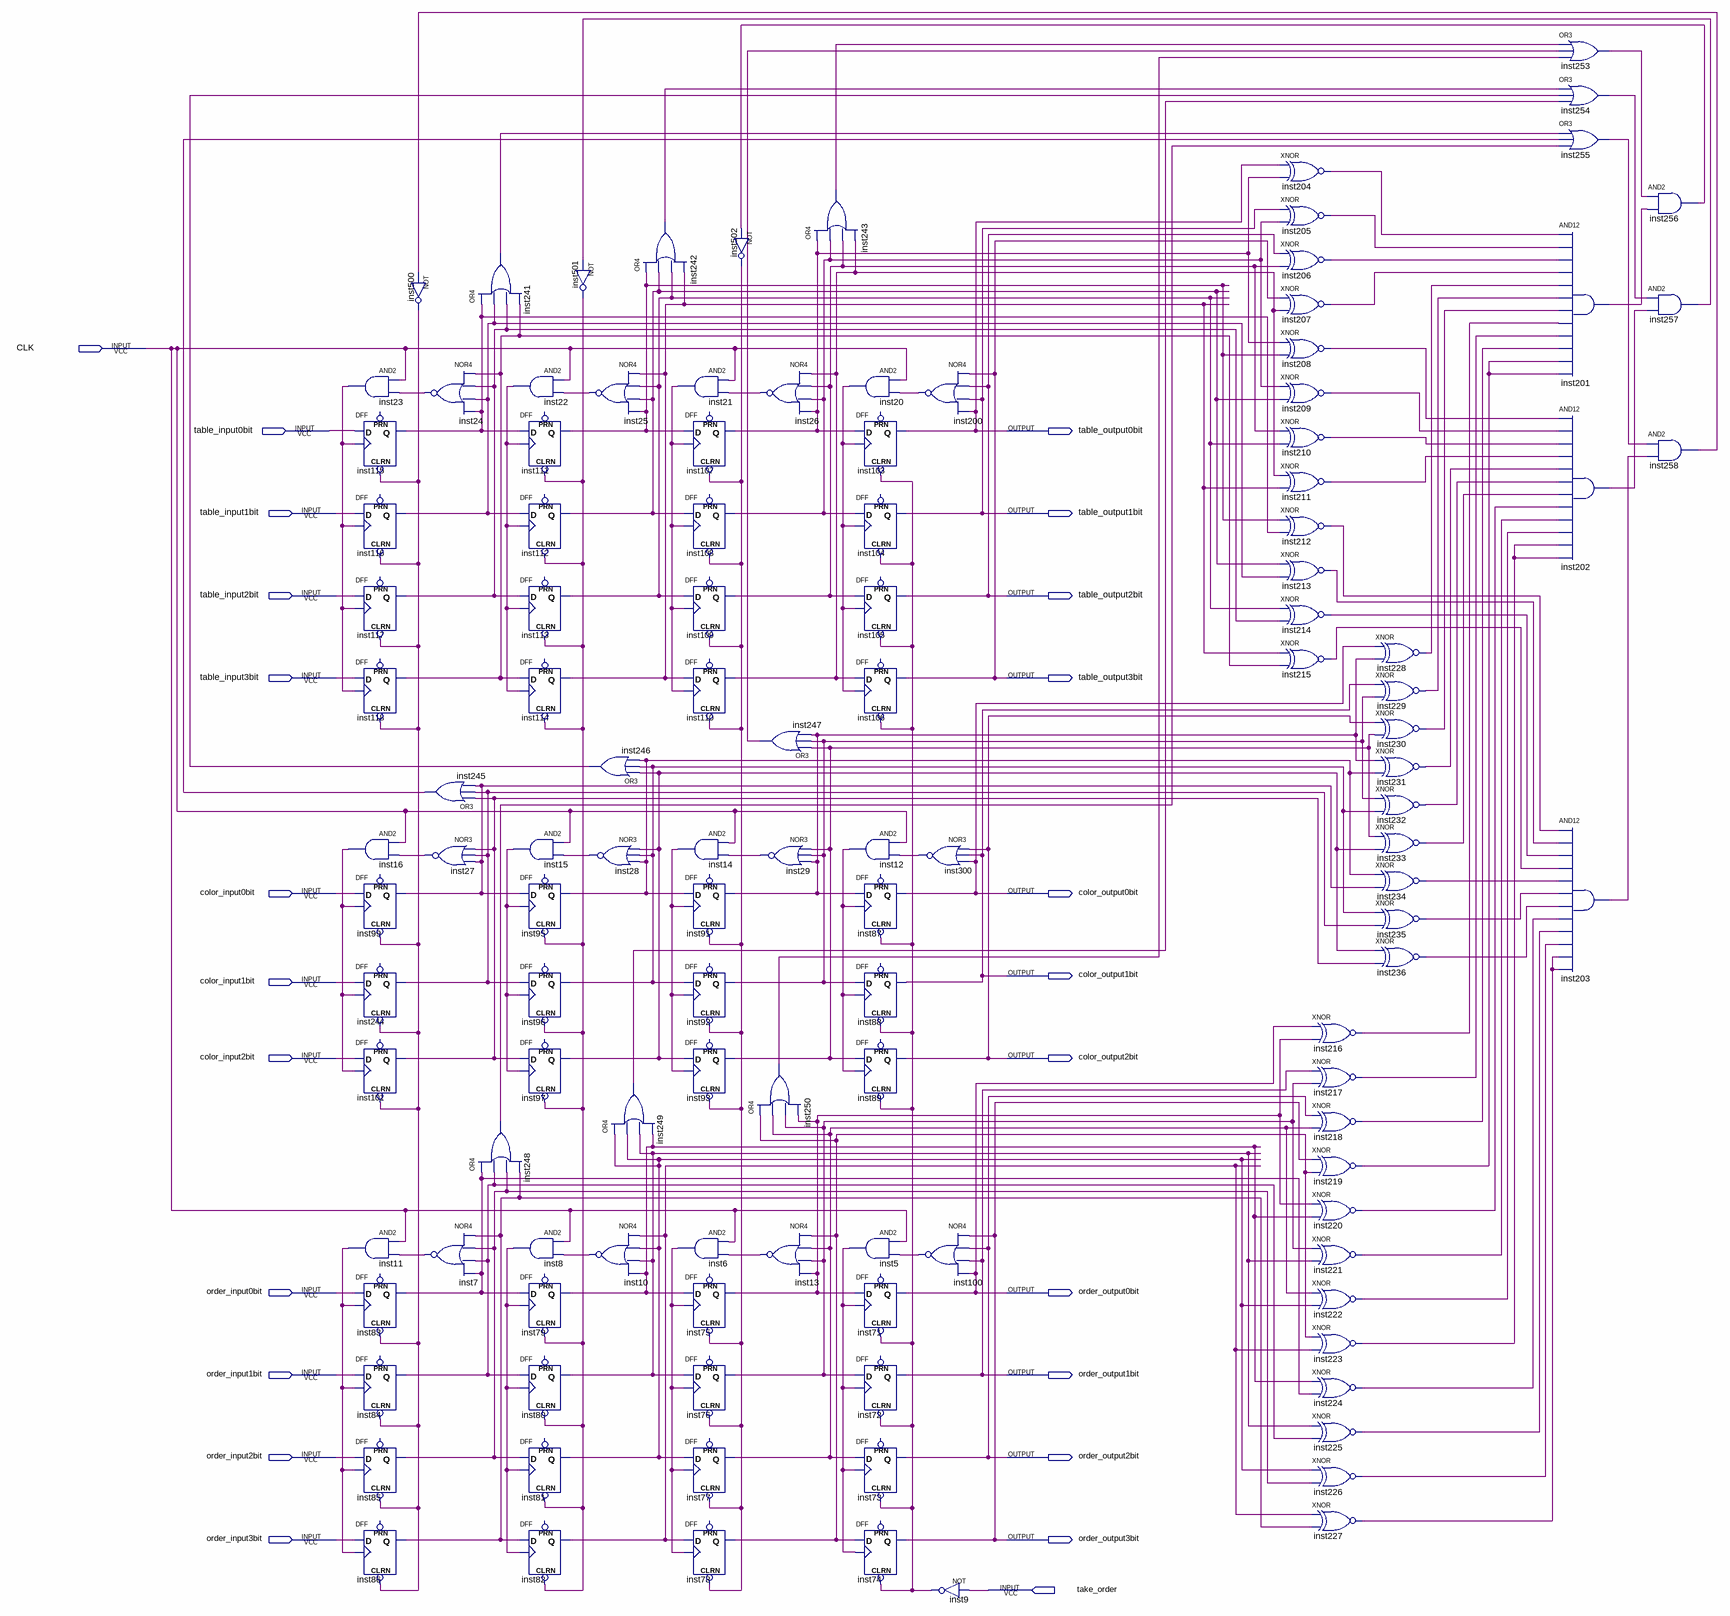
[diagram p0: schematic sheet]
// Quartus schematic order_register.bdf as structural Verilog: 123 symbols, 24 pins
module order_register (
  input  CLK,
  input  table_input0bit,
  input  table_input1bit,
  input  table_input2bit,
  input  table_input3bit,
  input  color_input0bit,
  input  color_input1bit,
  input  color_input2bit,
  input  order_input0bit,
  input  order_input1bit,
  input  order_input2bit,
  input  order_input3bit,
  input  take_order,
  output table_output0bit,
  output table_output1bit,
  output table_output2bit,
  output table_output3bit,
  output color_output0bit,
  output color_output1bit,
  output color_output2bit,
  output order_output0bit,
  output order_output1bit,
  output order_output2bit,
  output order_output3bit
);

  wire inst5_out, inst6_out, inst7_out, inst8_out, inst9_out, inst10_out, inst11_out, inst12_out, inst13_out,
       inst14_out, inst15_out, inst16_out, inst20_out, inst21_out, inst22_out, inst23_out, inst24_out,
       inst25_out, inst26_out, inst27_out, inst28_out, inst29_out, inst75_q, inst76_q, inst77_q, inst78_q,
       inst79_q, inst80_q, inst81_q, inst82_q, inst83_q, inst84_q, inst85_q, inst86_q, inst91_q, inst92_q,
       inst93_q, inst95_q, inst96_q, inst97_q, inst99_q, inst100_out, inst101_q, inst107_q, inst108_q,
       inst109_q, inst110_q, inst111_q, inst112_q, inst113_q, inst114_q, inst115_q, inst116_q, inst117_q,
       inst118_q, inst200_out, inst201_out, inst202_out, inst203_out, inst204_out, inst205_out, inst206_out,
       inst207_out, inst208_out, inst209_out, inst210_out, inst211_out, inst212_out, inst213_out,
       inst214_out, inst215_out, inst216_out, inst217_out, inst218_out, inst219_out, inst220_out,
       inst221_out, inst222_out, inst223_out, inst224_out, inst225_out, inst226_out, inst227_out,
       inst228_out, inst229_out, inst230_out, inst231_out, inst232_out, inst233_out, inst234_out,
       inst235_out, inst236_out, inst241_out, inst242_out, inst243_out, inst244_q, inst245_out, inst246_out,
       inst247_out, inst248_out, inst249_out, inst250_out, inst253_out, inst254_out, inst255_out,
       inst256_out, inst257_out, inst258_out, inst300_out, inst500_out, inst501_out, inst502_out;

  and inst23 (inst23_out, CLK, inst24_out);
  DFF inst115 (.CLRN(inst500_out), .CLK(inst23_out), .D(table_input0bit), .Q(inst115_q));  // open: PRN
  DFF inst116 (.CLRN(inst500_out), .CLK(inst23_out), .D(table_input1bit), .Q(inst116_q));  // open: PRN
  DFF inst117 (.CLRN(inst500_out), .CLK(inst23_out), .D(table_input2bit), .Q(inst117_q));  // open: PRN
  DFF inst118 (.CLRN(inst500_out), .CLK(inst23_out), .D(table_input3bit), .Q(inst118_q));  // open: PRN
  and inst16 (inst16_out, CLK, inst27_out);
  DFF inst99 (.CLRN(inst500_out), .CLK(inst16_out), .D(color_input0bit), .Q(inst99_q));  // open: PRN
  DFF inst244 (.CLRN(inst500_out), .CLK(inst16_out), .D(color_input1bit), .Q(inst244_q));  // open: PRN
  DFF inst101 (.CLRN(inst500_out), .CLK(inst16_out), .D(color_input2bit), .Q(inst101_q));  // open: PRN
  and inst11 (inst11_out, CLK, inst7_out);
  DFF inst83 (.CLRN(inst500_out), .CLK(inst11_out), .D(order_input0bit), .Q(inst83_q));  // open: PRN
  DFF inst84 (.CLRN(inst500_out), .CLK(inst11_out), .D(order_input1bit), .Q(inst84_q));  // open: PRN
  DFF inst85 (.CLRN(inst500_out), .CLK(inst11_out), .D(order_input2bit), .Q(inst85_q));  // open: PRN
  DFF inst86 (.CLRN(inst500_out), .CLK(inst11_out), .D(order_input3bit), .Q(inst86_q));  // open: PRN
  not inst500 (inst500_out, inst258_out);
  or inst241 (inst241_out, inst115_q, inst116_q, inst117_q, inst118_q);
  nor inst24 (inst24_out, inst118_q, inst117_q, inst116_q, inst115_q);
  or inst245 (inst245_out, inst101_q, inst244_q, inst99_q);
  nor inst27 (inst27_out, inst101_q, inst244_q, inst99_q);
  or inst248 (inst248_out, inst83_q, inst84_q, inst85_q, inst86_q);
  nor inst7 (inst7_out, inst86_q, inst85_q, inst84_q, inst83_q);
  and inst22 (inst22_out, CLK, inst25_out);
  DFF inst111 (.CLRN(inst501_out), .CLK(inst22_out), .D(inst115_q), .Q(inst111_q));  // open: PRN
  DFF inst112 (.CLRN(inst501_out), .CLK(inst22_out), .D(inst116_q), .Q(inst112_q));  // open: PRN
  DFF inst113 (.CLRN(inst501_out), .CLK(inst22_out), .D(inst117_q), .Q(inst113_q));  // open: PRN
  DFF inst114 (.CLRN(inst501_out), .CLK(inst22_out), .D(inst118_q), .Q(inst114_q));  // open: PRN
  and inst15 (inst15_out, CLK, inst28_out);
  DFF inst95 (.CLRN(inst501_out), .CLK(inst15_out), .D(inst99_q), .Q(inst95_q));  // open: PRN
  DFF inst96 (.CLRN(inst501_out), .CLK(inst15_out), .D(inst244_q), .Q(inst96_q));  // open: PRN
  DFF inst97 (.CLRN(inst501_out), .CLK(inst15_out), .D(inst101_q), .Q(inst97_q));  // open: PRN
  and inst8 (inst8_out, CLK, inst10_out);
  DFF inst79 (.CLRN(inst501_out), .CLK(inst8_out), .D(inst83_q), .Q(inst79_q));  // open: PRN
  DFF inst80 (.CLRN(inst501_out), .CLK(inst8_out), .D(inst84_q), .Q(inst80_q));  // open: PRN
  DFF inst81 (.CLRN(inst501_out), .CLK(inst8_out), .D(inst85_q), .Q(inst81_q));  // open: PRN
  DFF inst82 (.CLRN(inst501_out), .CLK(inst8_out), .D(inst86_q), .Q(inst82_q));  // open: PRN
  not inst501 (inst501_out, inst257_out);
  nor inst25 (inst25_out, inst114_q, inst113_q, inst112_q, inst111_q);
  or inst246 (inst246_out, inst97_q, inst96_q, inst95_q);
  nor inst28 (inst28_out, inst97_q, inst96_q, inst95_q);
  or inst249 (inst249_out, inst81_q, inst81_q, inst80_q, inst79_q);
  nor inst10 (inst10_out, inst82_q, inst81_q, inst80_q, inst79_q);
  or inst242 (inst242_out, inst111_q, inst112_q, inst113_q, inst114_q);
  and inst21 (inst21_out, CLK, inst26_out);
  DFF inst107 (.CLRN(inst502_out), .CLK(inst21_out), .D(inst111_q), .Q(inst107_q));  // open: PRN
  DFF inst108 (.CLRN(inst502_out), .CLK(inst21_out), .D(inst112_q), .Q(inst108_q));  // open: PRN
  DFF inst109 (.CLRN(inst502_out), .CLK(inst21_out), .D(inst113_q), .Q(inst109_q));  // open: PRN
  DFF inst110 (.CLRN(inst502_out), .CLK(inst21_out), .D(inst114_q), .Q(inst110_q));  // open: PRN
  and inst14 (inst14_out, CLK, inst29_out);
  DFF inst91 (.CLRN(inst502_out), .CLK(inst14_out), .D(inst95_q), .Q(inst91_q));  // open: PRN
  DFF inst92 (.CLRN(inst502_out), .CLK(inst14_out), .D(inst96_q), .Q(inst92_q));  // open: PRN
  DFF inst93 (.CLRN(inst502_out), .CLK(inst14_out), .D(inst97_q), .Q(inst93_q));  // open: PRN
  and inst6 (inst6_out, CLK, inst13_out);
  DFF inst75 (.CLRN(inst502_out), .CLK(inst6_out), .D(inst79_q), .Q(inst75_q));  // open: PRN
  DFF inst76 (.CLRN(inst502_out), .CLK(inst6_out), .D(inst80_q), .Q(inst76_q));  // open: PRN
  DFF inst77 (.CLRN(inst502_out), .CLK(inst6_out), .D(inst81_q), .Q(inst77_q));  // open: PRN
  DFF inst78 (.CLRN(inst502_out), .CLK(inst6_out), .D(inst82_q), .Q(inst78_q));  // open: PRN
  not inst502 (inst502_out, inst256_out);
  nor inst26 (inst26_out, inst110_q, inst109_q, inst108_q, inst107_q);
  or inst247 (inst247_out, inst93_q, inst92_q, inst91_q);
  nor inst29 (inst29_out, inst93_q, inst92_q, inst91_q);
  or inst250 (inst250_out, inst78_q, inst77_q, inst76_q, inst75_q);
  nor inst13 (inst13_out, inst78_q, inst77_q, inst76_q, inst75_q);
  or inst243 (inst243_out, inst107_q, inst108_q, inst109_q, inst110_q);
  and inst20 (inst20_out, CLK, inst200_out);
  DFF inst103 (.CLRN(inst9_out), .CLK(inst20_out), .D(inst107_q), .Q(table_output0bit));  // open: PRN
  DFF inst104 (.CLRN(inst9_out), .CLK(inst20_out), .D(inst108_q), .Q(table_output1bit));  // open: PRN
  DFF inst105 (.CLRN(inst9_out), .CLK(inst20_out), .D(inst109_q), .Q(table_output2bit));  // open: PRN
  DFF inst106 (.CLRN(inst9_out), .CLK(inst20_out), .D(inst110_q), .Q(table_output3bit));  // open: PRN
  and inst12 (inst12_out, CLK, inst300_out);
  DFF inst87 (.CLRN(inst9_out), .CLK(inst12_out), .D(inst91_q), .Q(color_output0bit));  // open: PRN
  DFF inst88 (.CLRN(inst9_out), .CLK(inst12_out), .D(inst92_q), .Q(color_output1bit));  // open: PRN
  DFF inst89 (.CLRN(inst9_out), .CLK(inst12_out), .D(inst93_q), .Q(color_output2bit));  // open: PRN
  and inst5 (inst5_out, CLK, inst100_out);
  DFF inst71 (.CLRN(inst9_out), .CLK(inst5_out), .D(inst75_q), .Q(order_output0bit));  // open: PRN
  DFF inst72 (.CLRN(inst9_out), .CLK(inst5_out), .D(inst76_q), .Q(order_output1bit));  // open: PRN
  DFF inst73 (.CLRN(inst9_out), .CLK(inst5_out), .D(inst77_q), .Q(order_output2bit));  // open: PRN
  DFF inst74 (.CLRN(inst9_out), .CLK(inst5_out), .D(inst78_q), .Q(order_output3bit));  // open: PRN
  nor inst200 (inst200_out, table_output3bit, table_output2bit, table_output1bit, table_output0bit);
  nor inst300 (inst300_out, color_output2bit, color_output1bit, color_output0bit);
  nor inst100 (inst100_out, order_output3bit, order_output2bit, order_output1bit, order_output0bit);
  not inst9 (inst9_out, take_order);
  xnor inst204 (inst204_out, table_output0bit, inst107_q);
  xnor inst205 (inst205_out, table_output1bit, inst108_q);
  xnor inst206 (inst206_out, table_output2bit, inst109_q);
  xnor inst207 (inst207_out, table_output3bit, inst110_q);
  xnor inst208 (inst208_out, inst107_q, inst111_q);
  xnor inst209 (inst209_out, inst108_q, inst112_q);
  xnor inst210 (inst210_out, inst109_q, inst113_q);
  xnor inst211 (inst211_out, inst110_q, inst114_q);
  xnor inst212 (inst212_out, inst111_q, inst115_q);
  xnor inst213 (inst213_out, inst112_q, inst116_q);
  xnor inst214 (inst214_out, inst113_q, inst117_q);
  xnor inst215 (inst215_out, inst114_q, inst118_q);
  xnor inst216 (inst216_out, order_output0bit, inst75_q);
  xnor inst217 (inst217_out, order_output1bit, inst76_q);
  xnor inst218 (inst218_out, order_output2bit, inst77_q);
  xnor inst219 (inst219_out, order_output3bit, inst78_q);
  xnor inst220 (inst220_out, inst75_q, inst79_q);
  xnor inst221 (inst221_out, inst76_q, inst80_q);
  xnor inst222 (inst222_out, inst77_q, inst81_q);
  xnor inst223 (inst223_out, inst78_q, inst82_q);
  xnor inst224 (inst224_out, inst79_q, inst83_q);
  xnor inst225 (inst225_out, inst80_q, inst84_q);
  xnor inst226 (inst226_out, inst81_q, inst85_q);
  xnor inst227 (inst227_out, inst82_q, inst86_q);
  xnor inst228 (inst228_out, color_output0bit, inst91_q);
  xnor inst229 (inst229_out, color_output1bit, inst92_q);
  xnor inst230 (inst230_out, color_output2bit, inst93_q);
  xnor inst231 (inst231_out, inst91_q, inst95_q);
  xnor inst232 (inst232_out, inst92_q, inst96_q);
  xnor inst233 (inst233_out, inst93_q, inst97_q);
  xnor inst234 (inst234_out, inst95_q, inst99_q);
  xnor inst235 (inst235_out, inst96_q, inst244_q);
  xnor inst236 (inst236_out, inst97_q, inst101_q);
  or inst253 (inst253_out, inst243_out, inst247_out, inst250_out);
  or inst254 (inst254_out, inst242_out, inst246_out, inst249_out);
  or inst255 (inst255_out, inst241_out, inst245_out, inst248_out);
  and inst201 (inst201_out, inst204_out, inst205_out, inst206_out, inst207_out, inst228_out, inst229_out, inst230_out, inst216_out, inst217_out, inst218_out, inst219_out, inst219_out);
  and inst202 (inst202_out, inst208_out, inst209_out, inst210_out, inst211_out, inst231_out, inst232_out, inst233_out, inst220_out, inst221_out, inst222_out, inst223_out, inst223_out);
  and inst203 (inst203_out, inst212_out, inst213_out, inst214_out, inst215_out, inst234_out, inst235_out, inst236_out, inst224_out, inst225_out, inst226_out, inst227_out, inst227_out);
  and inst256 (inst256_out, inst253_out, inst201_out);
  and inst257 (inst257_out, inst254_out, inst202_out);
  and inst258 (inst258_out, inst255_out, inst203_out);
endmodule
